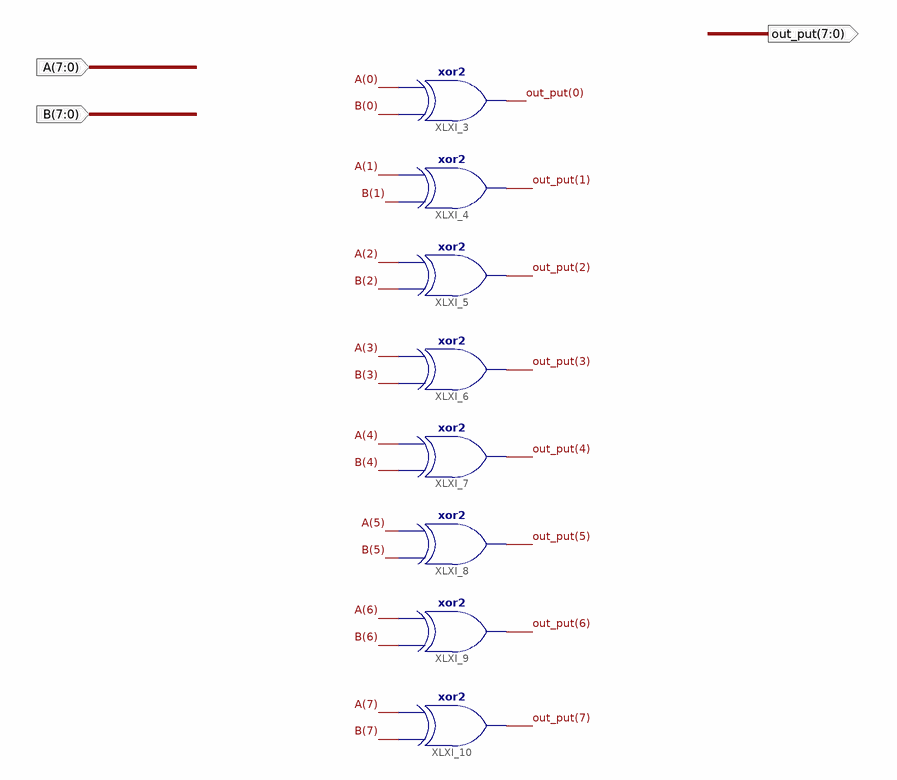
[diagram p0: schematic sheet 1]
// Xilinx ISE schematic Xor8bit.sch (spartan6) as structural Verilog: 8 symbols, 3 ports
module Xor8bit (
  input  [7:0] A,
  input  [7:0] B,
  output [7:0] out_put
);

  xor XLXI_3 (out_put[0], B[0], A[0]);
  xor XLXI_4 (out_put[1], B[1], A[1]);
  xor XLXI_5 (out_put[2], B[2], A[2]);
  xor XLXI_6 (out_put[3], B[3], A[3]);
  xor XLXI_7 (out_put[4], B[4], A[4]);
  xor XLXI_8 (out_put[5], B[5], A[5]);
  xor XLXI_9 (out_put[6], B[6], A[6]);
  xor XLXI_10 (out_put[7], B[7], A[7]);
endmodule
